# Altium schematic sheet Sheet1.SchDoc
size A
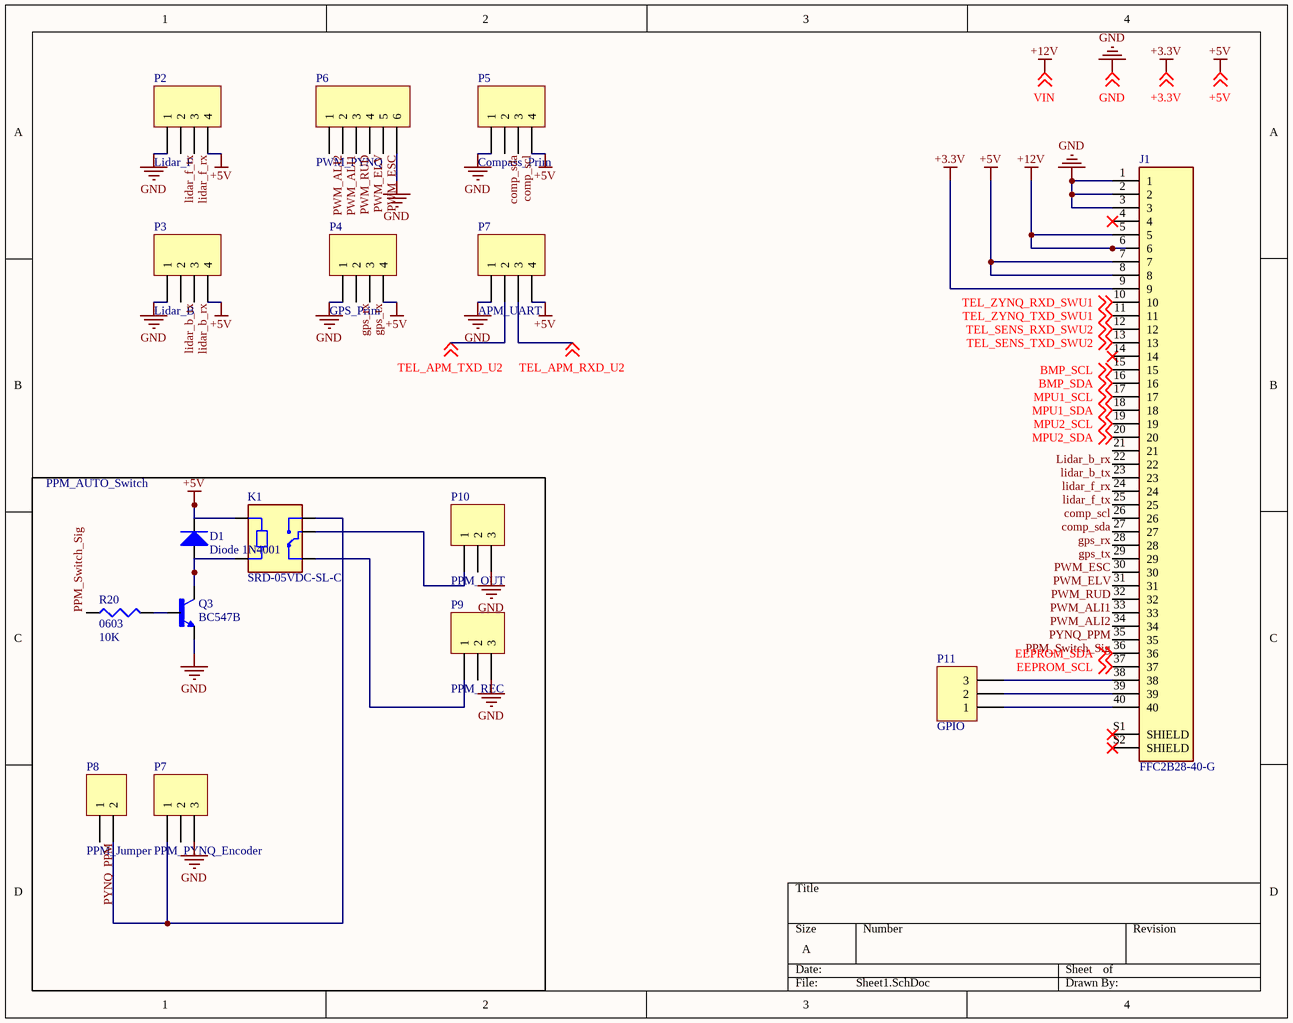
[diagram p0: Sheet1.SchDoc]

## Parts
(Parts that share a designator on the sheet are numbered #1, #2 ... from top to bottom, then left to right.)
D1  Diode 1N4001  [DO-41]
J1  FFC2B28-40-G  [GCT_FFC2B28-40-G]
K1  SRD-05VDC-SL-C  [RELAY_SRD-05VDC-SL-C]
P2  Lidar_F  [HDR1X4]
P3  Lidar_B  [HDR1X4]
P4  GPS_Prim  [HDR1X4]
P5  Compass_Prim  [HDR1X4]
P6  PWM_PYNQ  [HDR1X6]
P7#1  APM_UART  [HDR1X4]
P7#2  PPM_PYNQ_Encoder  [HDR1X3]
P8  PPM_Jumper  [HDR1X2]
P9  PPM_REC  [HDR1X3]
P10  PPM_OUT  [HDR1X3]
P11  GPIO  [HDR1X3]
Q3  BC547B  [TO92250P510H770-3]
R20  0603  value 10K  [J1-0603]

## Blocks framed on the sheet
PPM_AUTO_Switch: D1 K1 P7#2 P8-P10 Q3 R20

## Nets
+3.3V: J1.9 ; off-sheet +3.3V
+5V: D1.2(K) J1.7 J1.8 K1.A1 P2.4 P3.4 P4.4 P5.4 P7#1.4 ; off-sheet +5V
+12V: J1.5 J1.6 ; off-sheet VIN  [also labelled VIN]
GND: J1.1 J1.2 J1.3 P2.1 P3.1 P4.1 P5.1 P6.6 P7#1.1 P7#2.3 P9.3 P10.3 Q3.3(E) ; off-sheet GND
BMP_SCL: J1.15 ; off-sheet BMP_SCL
BMP_SDA: J1.16 ; off-sheet BMP_SDA
comp_scl: J1.25 P5.3
comp_sda: J1.26 P5.2
EEPROM_SCL: J1.37 ; off-sheet EEPROM_SCL
EEPROM_SDA: J1.36 ; off-sheet EEPROM_SDA
gps_rx: J1.27 P4.2
gps_tx: J1.28 P4.3
lidar_b_rx: J1.21 P3.3
lidar_b_tx: J1.22 P3.2
lidar_f_rx: J1.23 P2.3
lidar_f_tx: J1.24 P2.2
MPU1_SCL: J1.17 ; off-sheet MPU1_SCL
MPU1_SDA: J1.18 ; off-sheet MPU1_SDA
MPU2_SCL: J1.19 ; off-sheet MPU2_SCL
MPU2_SDA: J1.20 ; off-sheet MPU2_SDA
PPM_Switch_Sig: J1.35 R20.1
PWM_ALI1: J1.32 P6.2
PWM_ALI2: J1.33 P6.1
PWM_ELV: J1.30 P6.4
PWM_ESC: J1.29 P6.5
PWM_RUD: J1.31 P6.3
PYNQ_PPM: J1.34 P8.1
TEL_APM_RXD_U2: P7#1.3 ; off-sheet TEL_APM_RXD_U2
TEL_APM_TXD_U2: P7#1.2 ; off-sheet TEL_APM_TXD_U2
TEL_SENS_RXD_SWU2: J1.12 ; off-sheet TEL_SENS_RXD_SWU2
TEL_SENS_TXD_SWU2: J1.13 ; off-sheet TEL_SENS_TXD_SWU2
TEL_ZYNQ_RXD_SWU1: J1.10 ; off-sheet TEL_ZYNQ_RXD_SWU1
TEL_ZYNQ_TXD_SWU1: J1.11 ; off-sheet TEL_ZYNQ_TXD_SWU1
NetD1_1: D1.1(A) K1.A2 Q3.1(C)
NetJ1_38: J1.38 P11.3
NetJ1_39: J1.39 P11.2
NetJ1_40: J1.40 P11.1
NetK1_COM: K1.COM P10.1
NetK1_NC: K1.NC P9.1
NetK1_NO: K1.NO P7#2.1 P8.2
NetQ3_2: Q3.2(B) R20.2

Not connected (* = marked no-connect by the designer): J1 4* 14* S1(SHIELD)* S2(SHIELD)*; P7#2 2; P9 2; P10 2

## Library data of the parts
D1 = Diode 1N4001: 1 Amp General Purpose Rectifier; Published: 8-Jun-2000; LatestRevisionDate: 17-Jul-2002; LatestRevisionNote: Re-released for DXP Platform.; DatasheetVersion: 1998; PackageVersion: Aug-1999; PackageReference: DO-41; Publisher: Altium Limited; PackageDescription: Diode, Axial; Body 5.2 x 2.7 mm (LxDia. max), Lead Dia. 0.86 mm (max); Code_JEDEC: DO-204-AL; ComponentLink1Description: Manufacturer Link; ComponentLink1URL: http://www.fairchildsemi.com/; ComponentLink2Description: Datasheet; ComponentLink2URL: http://www.fairchildsemi.com/ds/1N%2F1N4001.pdf
J1 = FFC2B28-40-G: 40 Position FFC, FPC Connector Contacts, Top and Bottom 0.020 _0.50mm_ Surface Mount, Right Angle; MF: Global Connector Technology; Value: *; MP: FFC2B28-40-G; Package: Package Analog Devices; Price: None; Availability: Unavailable; SnapEDA_Link: https://www.snapeda.com/parts/FFC2B28-40-G/Global%20Connector%20Technology/view-part/4223068/?ref=snap
K1 = SRD-05VDC-SL-C: 5V Trigger Relay Module For Arduino And Raspberry Pi 5V Trigger Relay Module For Arduino And Raspberry Pi; Package: None; Availability: Unavailable; Value: *; MP: SRD-05VDC-SL-C; Price: None
P2-P5 P7#1 = Header 4: Header, 4-Pin; LatestRevisionDate: 17-Jul-2002; LatestRevisionNote: Re-released for DXP Platform.; Publisher: Altium Limited
P6 = Header 6: Header, 6-Pin; LatestRevisionDate: 17-Jul-2002; LatestRevisionNote: Re-released for DXP Platform.; Publisher: Altium Limited
P7#2 P9-P11 = Header 3: Header, 3-Pin; LatestRevisionDate: 17-Jul-2002; LatestRevisionNote: Re-released for DXP Platform.; Publisher: Altium Limited
P8 = Header 2: Header, 2-Pin; LatestRevisionDate: 17-Jul-2002; LatestRevisionNote: Re-released for DXP Platform.; Publisher: Altium Limited
Q3 = BC547B: <a href="https://pricing.snapeda.com/parts/BC337-16%20A1/Taiwan%20Semiconductor/view-part?ref=eda">Check availability</a> <a href="https://pricing.snapeda.com/parts/BC337-16%20A1/Taiwan%20Semiconductor/view-part?ref=eda">Check availability</a>; Price: None; Value: *; Package: None; Availability: Unavailable; MP: BC547B
R20 = Res3: Resistor; Published: 8-Jun-2000; LatestRevisionDate: 29-May-2009; LatestRevisionNote: IPC-7351 Footprint Added.; PackageReference: J1-0603; Publisher: Altium Limited; PackageDescription: Chip Resistor